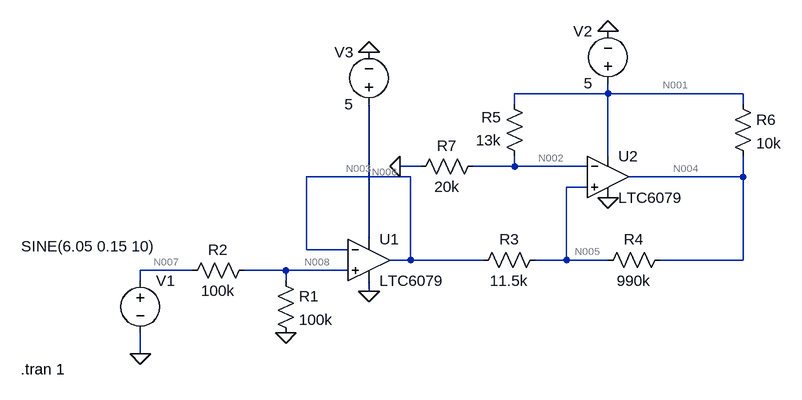
[diagram p0: schematic Draft1.asc]
Draft1.asc, the LTspice schematic file:
Version 4
SHEET 1 880 680
WIRE 560 -176 560 -192
WIRE 560 -176 416 -176
WIRE 768 -176 560 -176
WIRE 416 -160 416 -176
WIRE 768 -160 768 -176
WIRE 560 -80 560 -176
WIRE 272 -64 240 -64
WIRE 416 -64 416 -80
WIRE 416 -64 352 -64
WIRE 528 -64 416 -64
WIRE 256 -48 96 -48
WIRE 768 -48 768 -80
WIRE 768 -48 592 -48
WIRE 528 -32 496 -32
WIRE 192 48 192 -160
WIRE 96 64 96 -48
WIRE 160 64 96 64
WIRE 256 80 256 -48
WIRE 256 80 224 80
WIRE 368 80 256 80
WIRE 496 80 496 -32
WIRE 496 80 448 80
WIRE 560 80 496 80
WIRE 768 80 768 -48
WIRE 768 80 640 80
WIRE -80 96 -160 96
WIRE 64 96 0 96
WIRE 160 96 64 96
WIRE -160 112 -160 96
WIRE 64 112 64 96
WIRE 192 128 192 112
WIRE -160 224 -160 192
FLAG -160 224 0
FLAG 560 -16 0
FLAG 192 128 0
FLAG 560 -272 0
FLAG 64 192 0
FLAG 192 -240 0
FLAG 240 -64 0
SYMBOL res 48 96 R0
SYMATTR InstName R1
SYMATTR Value 100k
SYMBOL res 16 80 R90
WINDOW 0 0 56 VBottom 2
WINDOW 3 32 56 VTop 2
SYMATTR InstName R2
SYMATTR Value 100k
SYMBOL OpAmps\\LTC6079 192 80 R0
SYMATTR InstName U1
SYMBOL OpAmps\\LTC6079 560 -48 R0
SYMATTR InstName U2
SYMBOL res 464 64 R90
WINDOW 0 0 56 VBottom 2
WINDOW 3 32 56 VTop 2
SYMATTR InstName R3
SYMATTR Value 11.5k
SYMBOL res 656 64 R90
WINDOW 0 0 56 VBottom 2
WINDOW 3 32 56 VTop 2
SYMATTR InstName R4
SYMATTR Value 990k
SYMBOL res 432 -64 R180
WINDOW 0 36 76 Left 2
WINDOW 3 36 40 Left 2
SYMATTR InstName R5
SYMATTR Value 13k
SYMBOL voltage -160 96 R0
WINDOW 3 -183 -37 Left 2
WINDOW 123 0 0 Left 0
WINDOW 39 0 0 Left 0
SYMATTR InstName V1
SYMATTR Value SINE(6.05 0.15 10)
SYMBOL voltage 560 -176 R180
WINDOW 0 24 96 Left 2
WINDOW 3 24 16 Left 2
WINDOW 123 0 0 Left 0
WINDOW 39 0 0 Left 0
SYMATTR InstName V2
SYMATTR Value 5
SYMBOL voltage 192 -144 R180
WINDOW 0 24 96 Left 2
WINDOW 3 24 16 Left 2
WINDOW 123 0 0 Left 0
WINDOW 39 0 0 Left 0
SYMATTR InstName V3
SYMATTR Value 5
SYMBOL res 368 -80 R90
WINDOW 0 0 56 VBottom 2
WINDOW 3 32 56 VTop 2
SYMATTR InstName R7
SYMATTR Value 20k
SYMBOL res 752 -176 R0
SYMATTR InstName R6
SYMATTR Value 10k
TEXT -344 248 Left 2 !.tran 1

The netlist it stands for:
* Draft1.asc
R1 N008 0 100k
R2 N008 N007 100k
XU1 N008 N003 N006 0 N003 LTC6078  ; LTC6079, pins In+ In- V+ V- OUT
XU2 N005 N002 N001 0 N004 LTC6078  ; LTC6079, pins In+ In- V+ V- OUT
R3 N005 N003 11.5k
R4 N004 N005 990k
R5 N002 N001 13k
V1 N007 0 SINE(6.05 0.15 10)
V2 N001 0 5
V3 N006 0 5
R7 N002 0 20k
R6 N001 N004 10k
.tran 1
.lib LTC5.lib
.backanno
.end

* Results of the author's LTspice run, read from the files saved beside the schematic
* Operating Point, zero values left out:
*   V(n008) = 3.025 V
*   V(n007) = 6.05 V
*   V(n006) = 5 V
*   V(n003) = 3.025 V
*   V(n001) = 5 V
*   V(n005) = 2.991 V
*   V(n002) = 3.03 V
*   V(n004) = 26.64 mV
*   I(R6) = 497.3 µA
*   I(R7) = 151.5 µA
*   I(R5) = -151.5 µA
*   I(R4) = -2.994 µA
*   I(R3) = -2.994 µA
*   I(R2) = -30.25 µA
*   I(R1) = 30.25 µA
*   I(V3) = -56.46 µA
*   I(V2) = -684.9 µA
*   I(V1) = -30.25 µA
*   Ix(u1:3) = 56.46 µA
*   Ix(u1:4) = -53.46 µA
*   Ix(u1:5) = -2.994 µA
*   Ix(u2:3) = 36.04 µA
*   Ix(u2:4) = -536.4 µA
*   Ix(u2:5) = 500.3 µA
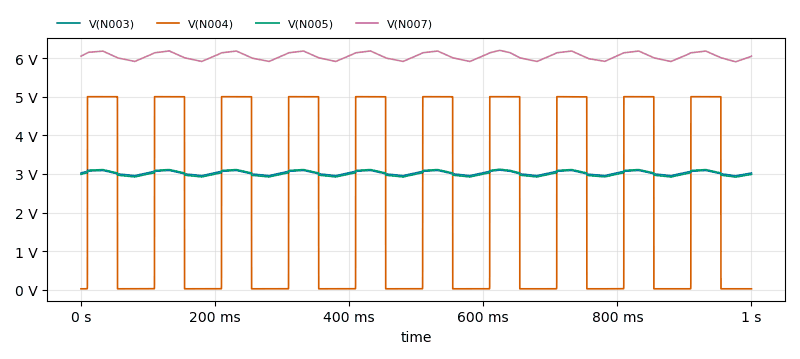
[diagram p1: Transient Analysis of Draft1.asc, plotted from the saved traces]
* Transient Analysis, 1 run:
*   V(N003): min 2.952 V, max 3.1 V, average 3.027 V, rms 3.027 V, last 3.025 V
*   V(N004): min 26.58 mV, max 5 V, average 2.254 V, rms 3.345 V, last 26.64 mV
*   V(N005): min 2.918 V, max 3.121 V, average 3.018 V, rms 3.019 V, last 2.991 V
*   V(N007): min 5.903 V, max 6.199 V, average 6.053 V, rms 6.054 V, last 6.05 V